# Altium schematic sheet AND_4x4.SchDoc
size A4; SheetNumber: 1; SheetTotal: 1
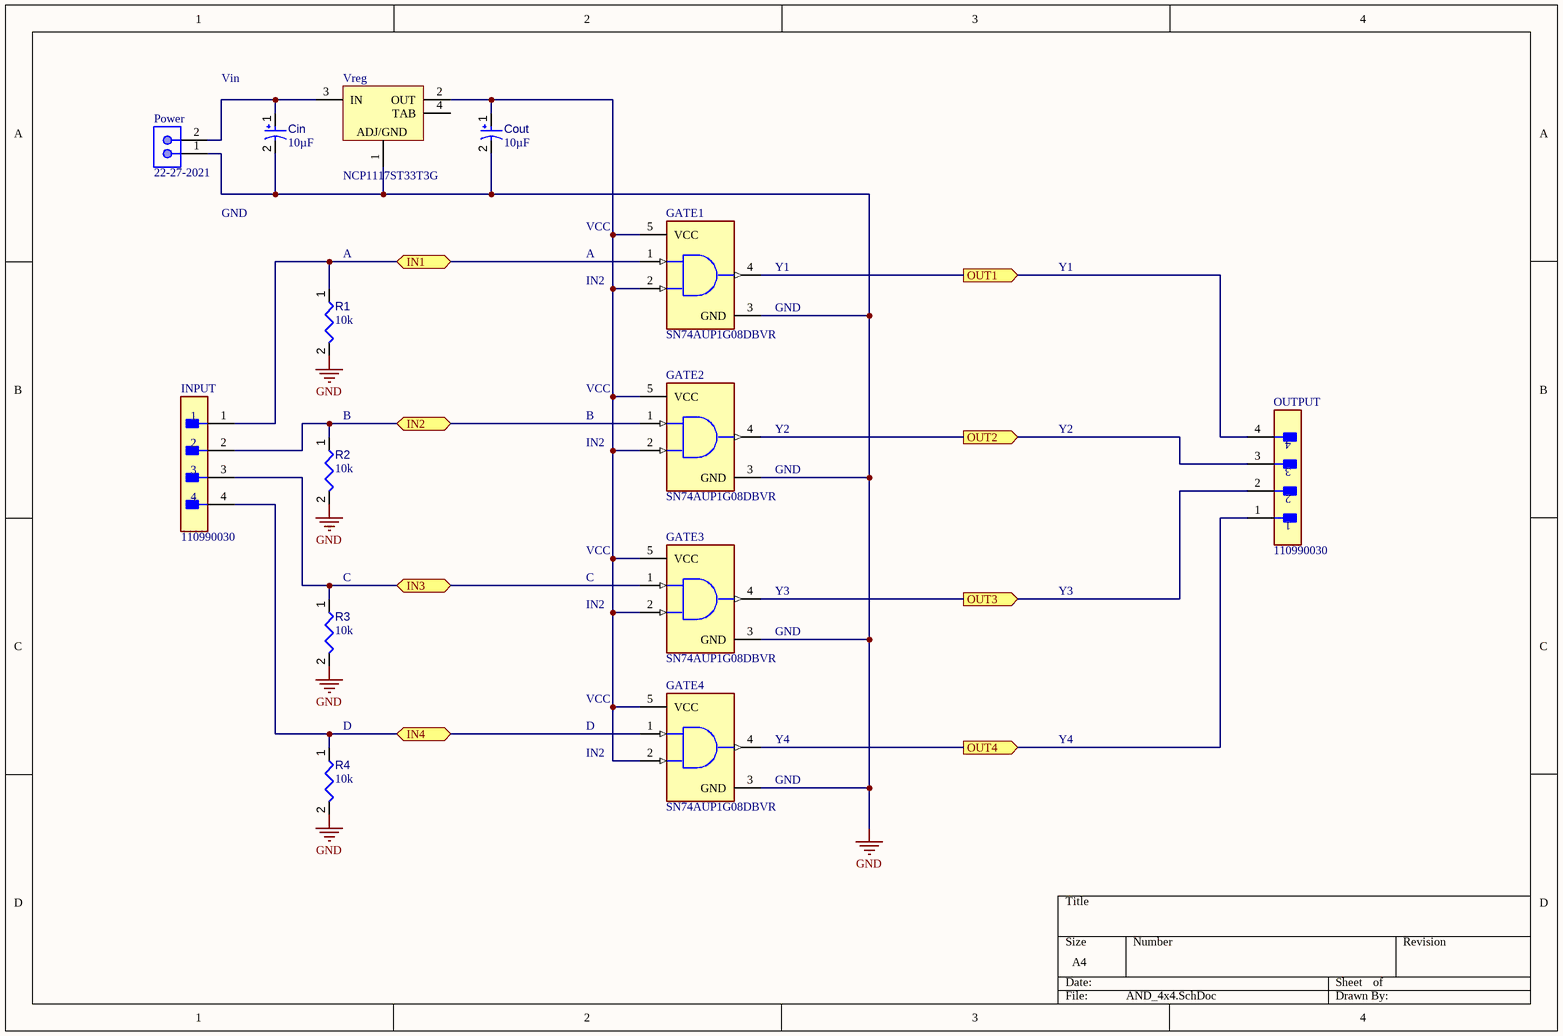
[diagram p0: AND_4x4.SchDoc]

## Parts
Cin  value 10µF  [CAPPR55-200-1100X500X1200]  (hidden comment: ECA1HM100)
Cout  value 10µF  [CAPPR55-200-1100X500X1200]  (hidden comment: ECA1HM100)
GATE1  SN74AUP1G08DBVR  [FP-DBV0005A-IPC_C]
GATE2  SN74AUP1G08DBVR  [FP-DBV0005A-IPC_C]
GATE3  SN74AUP1G08DBVR  [FP-DBV0005A-IPC_C]
GATE4  SN74AUP1G08DBVR  [FP-DBV0005A-IPC_C]
INPUT  110990030  [FP-110990030-MFG]
OUTPUT  110990030  [FP-110990030-MFG]
Power  22-27-2021  [MOLX-22-27-2021_V]
R1  value 10k  [RESC0402(1005)_L]  (hidden comment: Resistor 10K  +/-1 % 0402 63 mW)
R2  value 10k  [RESC0402(1005)_L]  (hidden comment: Resistor 10K  +/-1 % 0402 63 mW)
R3  value 10k  [RESC0402(1005)_L]  (hidden comment: Resistor 10K  +/-1 % 0402 63 mW)
R4  value 10k  [RESC0402(1005)_L]  (hidden comment: Resistor 10K  +/-1 % 0402 63 mW)
Vreg  NCP1117ST33T3G  [ONSC-SOT-223-4-318H-01_A_V]

## Ports
IN1 (bidir), IN2 (bidir), IN3 (bidir), IN4 (bidir), OUT1 (out), OUT2 (out), OUT3 (out), OUT4 (out)

## Nets
GND: Cin.2 Cout.2 GATE1.3(GND) GATE2.3(GND) GATE3.3(GND) GATE4.3(GND) Power.1 R1.2 R2.2 R3.2 R4.2 Vreg.1(ADJ/GND)
IN1: GATE1.1(A) INPUT.1 R1.1 ; port IN1
IN2: GATE2.1(A) INPUT.2 R2.1 ; port IN2
IN3: GATE3.1(A) INPUT.3 R3.1 ; port IN3
IN4: GATE4.1(A) INPUT.4 R4.1 ; port IN4
OUT1: GATE1.4(Y) OUTPUT.4 ; port OUT1
OUT2: GATE2.4(Y) OUTPUT.3 ; port OUT2
OUT3: GATE3.4(Y) OUTPUT.2 ; port OUT3
OUT4: GATE4.4(Y) OUTPUT.1 ; port OUT4
NetCin_1: Cin.1 Power.2 Vreg.3(IN)
NetCout_1: Cout.1 GATE1.2(B) GATE1.5(VCC) GATE2.2(B) GATE2.5(VCC) GATE3.2(B) GATE3.5(VCC) GATE4.2(B) GATE4.5(VCC) Vreg.2(OUT)

Not connected (* = marked no-connect by the designer): Vreg 4(TAB)

## Notes on the sheet
- Vin
- GND
- VCC
- (near R1) A
- A
- IN2
- (near GATE1) Y1
- (near GATE1) GND
- Y1
- (near R2) B
- B
- (near GATE2) Y2
- Y2
- (near GATE2) GND
- (near R3) C
- C
- (near GATE3) Y3
- (near GATE3) GND
- Y3
- (near R4) D
- D
- (near GATE4) Y4
- (near GATE4) GND
- Y4

## Library data of the parts
Cin Cout = CMP-001-00025-7: Aluminum Electrolytic Capacitor, 10 uF, +/- 20%, 50 V, -40 to 85 degC, 2-Pin THD, RoHS, Bulk; Manufacturer: Panasonic; Ripple Current (AC): 65mA; Voltage Rating: 50V; Mounting Technology: TH; RoHS Compliant: True; Capacitor Type: Electrolytic; Datasheet Version: Rev. 05, 10/2016; Min Operating Temperature: -40°C; Packaging: Bulk; Ripple Current: 65mA; Tolerance: 20%; Max Operating Temperature: 85°C; Datasheet URL: https://industrial.panasonic.com/cdbs/www-data/pdf/RDF0000/ABA0000C1218.pdf; Lead Pitch: 2mm; Pins: 2; Diameter: 5mm; Manufacturer URL: http://www.panasonic.com/; Package Reference: CAPPR55-200-1100X500X1200; Package Description: 2-Pin Radial Lead, Dia 5 mm, Height 12 mm; Case/Package: Radial; Package Quantity: 200
GATE1-GATE4 = CMP-0859-00066-4: IC GATE AND 1CH 2-INP SOT23-5; Number of Outputs: 1; Number of Inputs: 2; Propagation Delay: 6.2ns; Low Level Output Current: 4mA; Min Supply Voltage: 800mV; Quiescent Current: 500nA; Input Type: SCHMITT TRIGGER; Logic Function: AND GATE; Max Supply Voltage: 3.6V; High Level Output Current: -4mA; Turn-On Delay Time: 20.9ns; RoHS Compliant: Yes; Number of Gates: 1; Packaging: Tape and Reel; Mount: Surface Mount; Number of Pins: 5; Contact Plating: Tin; Number of Circuits: 1; Case/Package: SOT-23; Technology: CMOS; Weight: 0.000395oz; Lead Free: Lead Free; Package Quantity: 3000; Radiation Hardening: No; Max Operating Temperature: 85°C; Number of Bits: 1; Number of Output Lines: 1; Output Current: 4mA; Min Operating Temperature: -40°C; Number of Elements: 1; Series: 74AUP; Number of Input Lines: 2; REACH SVHC: No SVHC
INPUT OUTPUT = CMP-139044-000001-1: GROVE 2MM 4PIN VERT CONN 10PCS; Series: -
Power = CMP-2000-05537-1: Male Header, Pitch 2.54 mm, 1 x 2 Position, Height 11.7 mm, Tail Length 3.56 mm, 0 to 75 degC, RoHS, Bulk; Manufacturer: Molex; PartNumber: 0022272021; Current rating: 4A; Package Version: Rev. BC, 02/2012; Voltage rating: 250V; No. of Positions: 2; Pitch: 2.54mm; No. of Rows: 1; Orientation: Vertical; Operating temperature: 0°Cto+75°C; Manufacturer URL: http://www.molex.com/; Mounting Technology: ThroughHole; Housing material: Nylon(UL94V-0); Package Description: 2-Leads Header, Body 5.08 x 5.8 mm, Pitch 2.54 mm; Voltage - Max: 250V; Datasheet URL: http://www.molex.com/pdm_docs/sd/022272021_sd.pdf; Package Reference: 22-27-2021; Contact material: Tinplatedbrass; Current - Max: 4A; Datasheet Version: Rev. F, 06/2009
R1-R4 = CMP-009-00149-3: Chip Resistor, 10 kOhms, +/-1 %, 63 mW, -55 to 125 degC, 0402; Power: 63mW; Tolerance: 1%; Min Operating Temperature: -55°C; Case/Package: 0402; Max Operating Temperature: 155°C; Pins: 2
Vreg = CMP-1679-00010-1: Low-Dropout Positive Fixed Voltage Regulator, 1 A, 3.3 V Output Voltage, 0 to 125 degC, 4-Pin SOT-223 (318H-01), Pb-Free, Tape and Reel; Resistance: 220 kohm; Type (Resistor): Thick Film; Voltage Rating: 75 V; Tolerance: 1%; Case\Package: 0603; Power Rating: 100 mW; Width: 0.85 mm; Weight: 7.1E-05 oz; ComponentLink2URL: http://www.onsemi.com/pub_link/Collateral/NCP1117-D.PDF; RoHSCompliant: true; Height: 0.45 mm; PackageDescription: 4-Pin Small Outline Transistor, Body 6.5 x 3.5 mm, Pitch 2.3 mm; ComponentLink1Description: Manufacturer URL; ComponentLink1URL: http://www.onsemi.com/; PackageReference: SOT-223-4-318H-01_A; Max Operating Temperature: 155 degC; Packaging: Tape and Reel; REACH SVHC: Unknown; Length: 1.55 mm; Package Quantity: 5000; Radiation Hardening: No; Min Operating Temperature: -55 degC; DatasheetVersion: Rev. 27, 09/2014; Mount: Surface Mount; Case Code (Imperial): 0603; Case Code (Metric): 1608; ComponentLink2Description: Datasheet